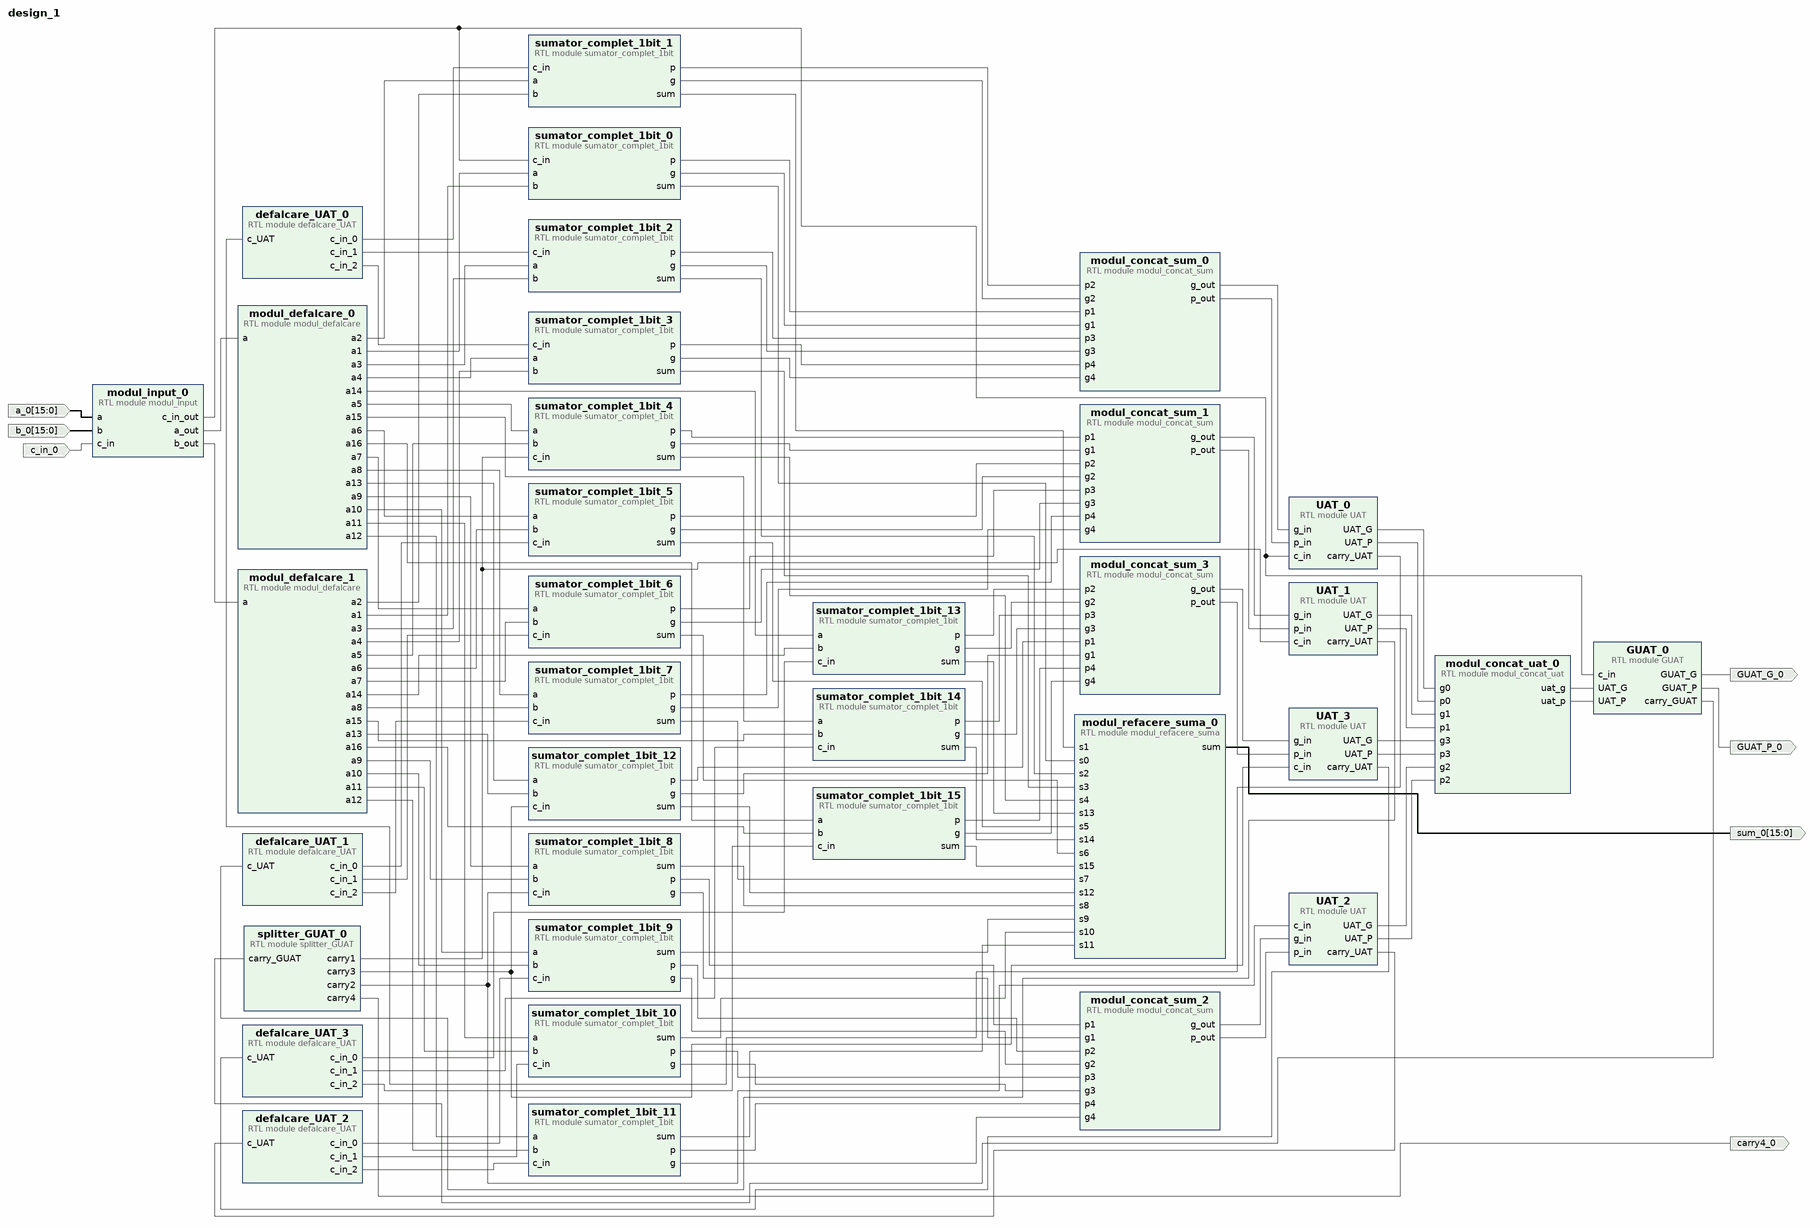
[diagram p0: block diagram of the top level]
# Vivado block design design_1, xc7a100tcsg324-1, Vivado 2020.2
create_bd_design design_1

create_bd_port -dir I -from 15 -to 0 a_0
create_bd_port -dir I -from 15 -to 0 b_0
create_bd_port -dir I c_in_0
create_bd_port -dir O carry4_0
create_bd_port -dir O GUAT_G_0
create_bd_port -dir O GUAT_P_0
create_bd_port -dir O -from 15 -to 0 sum_0

create_bd_cell -type module -reference sumator_complet_1bit sumator_complet_1bit_0
create_bd_cell -type module -reference sumator_complet_1bit sumator_complet_1bit_1
create_bd_cell -type module -reference sumator_complet_1bit sumator_complet_1bit_2
create_bd_cell -type module -reference sumator_complet_1bit sumator_complet_1bit_3
create_bd_cell -type module -reference UAT UAT_0
create_bd_cell -type module -reference modul_concat_sum modul_concat_sum_0
create_bd_cell -type module -reference GUAT GUAT_0
create_bd_cell -type module -reference sumator_complet_1bit sumator_complet_1bit_4
create_bd_cell -type module -reference sumator_complet_1bit sumator_complet_1bit_5
create_bd_cell -type module -reference sumator_complet_1bit sumator_complet_1bit_6
create_bd_cell -type module -reference sumator_complet_1bit sumator_complet_1bit_7
create_bd_cell -type module -reference modul_concat_sum modul_concat_sum_1
create_bd_cell -type module -reference modul_defalcare modul_defalcare_0
create_bd_cell -type module -reference modul_defalcare modul_defalcare_1
create_bd_cell -type module -reference UAT UAT_1
create_bd_cell -type module -reference sumator_complet_1bit sumator_complet_1bit_8
create_bd_cell -type module -reference sumator_complet_1bit sumator_complet_1bit_9
create_bd_cell -type module -reference sumator_complet_1bit sumator_complet_1bit_10
create_bd_cell -type module -reference sumator_complet_1bit sumator_complet_1bit_11
create_bd_cell -type module -reference modul_concat_sum modul_concat_sum_2
create_bd_cell -type module -reference UAT UAT_2
create_bd_cell -type module -reference modul_input modul_input_0
create_bd_cell -type module -reference sumator_complet_1bit sumator_complet_1bit_12
create_bd_cell -type module -reference sumator_complet_1bit sumator_complet_1bit_13
create_bd_cell -type module -reference sumator_complet_1bit sumator_complet_1bit_14
create_bd_cell -type module -reference sumator_complet_1bit sumator_complet_1bit_15
create_bd_cell -type module -reference modul_concat_sum modul_concat_sum_3
create_bd_cell -type module -reference UAT UAT_3
create_bd_cell -type module -reference splitter_GUAT splitter_GUAT_0
create_bd_cell -type module -reference modul_concat_uat modul_concat_uat_0
create_bd_cell -type module -reference defalcare_UAT defalcare_UAT_0
create_bd_cell -type module -reference defalcare_UAT defalcare_UAT_1
create_bd_cell -type module -reference defalcare_UAT defalcare_UAT_2
create_bd_cell -type module -reference defalcare_UAT defalcare_UAT_3
create_bd_cell -type module -reference modul_refacere_suma modul_refacere_suma_0

# ---- connections ----

connect_bd_net [get_bd_pins sumator_complet_1bit_0/p] [get_bd_pins modul_concat_sum_0/p1]
connect_bd_net [get_bd_pins sumator_complet_1bit_1/p] [get_bd_pins modul_concat_sum_0/p2]
connect_bd_net [get_bd_pins sumator_complet_1bit_2/p] [get_bd_pins modul_concat_sum_0/p3]
connect_bd_net [get_bd_pins sumator_complet_1bit_3/p] [get_bd_pins modul_concat_sum_0/p4]
connect_bd_net [get_bd_pins sumator_complet_1bit_0/g] [get_bd_pins modul_concat_sum_0/g1]
connect_bd_net [get_bd_pins sumator_complet_1bit_1/g] [get_bd_pins modul_concat_sum_0/g2]
connect_bd_net [get_bd_pins sumator_complet_1bit_2/g] [get_bd_pins modul_concat_sum_0/g3]
connect_bd_net [get_bd_pins sumator_complet_1bit_3/g] [get_bd_pins modul_concat_sum_0/g4]
connect_bd_net [get_bd_pins sumator_complet_1bit_4/p] [get_bd_pins modul_concat_sum_1/p1]
connect_bd_net [get_bd_pins sumator_complet_1bit_5/p] [get_bd_pins modul_concat_sum_1/p2]
connect_bd_net [get_bd_pins sumator_complet_1bit_6/p] [get_bd_pins modul_concat_sum_1/p3]
connect_bd_net [get_bd_pins sumator_complet_1bit_7/p] [get_bd_pins modul_concat_sum_1/p4]
connect_bd_net [get_bd_pins sumator_complet_1bit_4/g] [get_bd_pins modul_concat_sum_1/g1]
connect_bd_net [get_bd_pins sumator_complet_1bit_5/g] [get_bd_pins modul_concat_sum_1/g2]
connect_bd_net [get_bd_pins sumator_complet_1bit_6/g] [get_bd_pins modul_concat_sum_1/g3]
connect_bd_net [get_bd_pins sumator_complet_1bit_7/g] [get_bd_pins modul_concat_sum_1/g4]
connect_bd_net [get_bd_pins modul_concat_sum_0/g_out] [get_bd_pins UAT_0/g_in]
connect_bd_net [get_bd_pins modul_concat_sum_0/p_out] [get_bd_pins UAT_0/p_in]
connect_bd_net [get_bd_pins modul_concat_sum_1/g_out] [get_bd_pins UAT_1/g_in]
connect_bd_net [get_bd_pins modul_concat_sum_1/p_out] [get_bd_pins UAT_1/p_in]
connect_bd_net [get_bd_pins sumator_complet_1bit_8/p] [get_bd_pins modul_concat_sum_2/p1]
connect_bd_net [get_bd_pins sumator_complet_1bit_9/p] [get_bd_pins modul_concat_sum_2/p2]
connect_bd_net [get_bd_pins sumator_complet_1bit_10/p] [get_bd_pins modul_concat_sum_2/p3]
connect_bd_net [get_bd_pins sumator_complet_1bit_11/p] [get_bd_pins modul_concat_sum_2/p4]
connect_bd_net [get_bd_pins sumator_complet_1bit_8/g] [get_bd_pins modul_concat_sum_2/g1]
connect_bd_net [get_bd_pins sumator_complet_1bit_9/g] [get_bd_pins modul_concat_sum_2/g2]
connect_bd_net [get_bd_pins sumator_complet_1bit_10/g] [get_bd_pins modul_concat_sum_2/g3]
connect_bd_net [get_bd_pins sumator_complet_1bit_11/g] [get_bd_pins modul_concat_sum_2/g4]
connect_bd_net [get_bd_pins modul_concat_sum_2/g_out] [get_bd_pins UAT_2/g_in]
connect_bd_net [get_bd_pins modul_concat_sum_2/p_out] [get_bd_pins UAT_2/p_in]
connect_bd_net [get_bd_pins modul_defalcare_0/a1] [get_bd_pins sumator_complet_1bit_0/a]
connect_bd_net [get_bd_pins modul_defalcare_0/a2] [get_bd_pins sumator_complet_1bit_1/a]
connect_bd_net [get_bd_pins modul_defalcare_0/a3] [get_bd_pins sumator_complet_1bit_2/a]
connect_bd_net [get_bd_pins modul_defalcare_0/a4] [get_bd_pins sumator_complet_1bit_3/a]
connect_bd_net [get_bd_pins modul_defalcare_0/a5] [get_bd_pins sumator_complet_1bit_4/a]
connect_bd_net [get_bd_pins modul_defalcare_0/a6] [get_bd_pins sumator_complet_1bit_5/a]
connect_bd_net [get_bd_pins modul_defalcare_0/a7] [get_bd_pins sumator_complet_1bit_6/a]
connect_bd_net [get_bd_pins modul_defalcare_0/a8] [get_bd_pins sumator_complet_1bit_7/a]
connect_bd_net [get_bd_pins modul_defalcare_0/a9] [get_bd_pins sumator_complet_1bit_8/a]
connect_bd_net [get_bd_pins modul_defalcare_0/a10] [get_bd_pins sumator_complet_1bit_9/a]
connect_bd_net [get_bd_pins modul_defalcare_0/a11] [get_bd_pins sumator_complet_1bit_10/a]
connect_bd_net [get_bd_pins modul_defalcare_0/a12] [get_bd_pins sumator_complet_1bit_11/a]
connect_bd_net [get_bd_pins modul_input_0/a_out] [get_bd_pins modul_defalcare_0/a]
connect_bd_net [get_bd_pins modul_input_0/b_out] [get_bd_pins modul_defalcare_1/a]
connect_bd_net -net a_0_1 [get_bd_ports a_0] [get_bd_pins modul_input_0/a]
connect_bd_net -net b_0_1 [get_bd_ports b_0] [get_bd_pins modul_input_0/b]
connect_bd_net -net c_in_0_1 [get_bd_ports c_in_0] [get_bd_pins modul_input_0/c_in]
connect_bd_net [get_bd_pins modul_defalcare_1/a1] [get_bd_pins sumator_complet_1bit_0/b]
connect_bd_net [get_bd_pins modul_defalcare_1/a2] [get_bd_pins sumator_complet_1bit_1/b]
connect_bd_net [get_bd_pins modul_defalcare_1/a3] [get_bd_pins sumator_complet_1bit_2/b]
connect_bd_net [get_bd_pins modul_defalcare_1/a4] [get_bd_pins sumator_complet_1bit_3/b]
connect_bd_net [get_bd_pins modul_defalcare_1/a5] [get_bd_pins sumator_complet_1bit_4/b]
connect_bd_net [get_bd_pins modul_defalcare_1/a6] [get_bd_pins sumator_complet_1bit_5/b]
connect_bd_net [get_bd_pins modul_defalcare_1/a7] [get_bd_pins sumator_complet_1bit_6/b]
connect_bd_net [get_bd_pins modul_defalcare_1/a8] [get_bd_pins sumator_complet_1bit_7/b]
connect_bd_net [get_bd_pins modul_defalcare_1/a9] [get_bd_pins sumator_complet_1bit_8/b]
connect_bd_net [get_bd_pins modul_defalcare_1/a10] [get_bd_pins sumator_complet_1bit_9/b]
connect_bd_net [get_bd_pins modul_defalcare_1/a11] [get_bd_pins sumator_complet_1bit_10/b]
connect_bd_net [get_bd_pins modul_defalcare_1/a12] [get_bd_pins sumator_complet_1bit_11/b]
connect_bd_net [get_bd_pins modul_input_0/c_in_out] [get_bd_pins sumator_complet_1bit_0/c_in] [get_bd_pins UAT_0/c_in] [get_bd_pins GUAT_0/c_in]
connect_bd_net [get_bd_pins sumator_complet_1bit_12/p] [get_bd_pins modul_concat_sum_3/p1]
connect_bd_net [get_bd_pins sumator_complet_1bit_13/p] [get_bd_pins modul_concat_sum_3/p2]
connect_bd_net [get_bd_pins sumator_complet_1bit_14/p] [get_bd_pins modul_concat_sum_3/p3]
connect_bd_net [get_bd_pins sumator_complet_1bit_15/p] [get_bd_pins modul_concat_sum_3/p4]
connect_bd_net [get_bd_pins sumator_complet_1bit_12/g] [get_bd_pins modul_concat_sum_3/g1]
connect_bd_net [get_bd_pins sumator_complet_1bit_13/g] [get_bd_pins modul_concat_sum_3/g2]
connect_bd_net [get_bd_pins sumator_complet_1bit_14/g] [get_bd_pins modul_concat_sum_3/g3]
connect_bd_net [get_bd_pins sumator_complet_1bit_15/g] [get_bd_pins modul_concat_sum_3/g4]
connect_bd_net [get_bd_pins modul_concat_sum_3/g_out] [get_bd_pins UAT_3/g_in]
connect_bd_net [get_bd_pins modul_concat_sum_3/p_out] [get_bd_pins UAT_3/p_in]
connect_bd_net [get_bd_pins modul_defalcare_0/a13] [get_bd_pins sumator_complet_1bit_12/a]
connect_bd_net [get_bd_pins modul_defalcare_0/a14] [get_bd_pins sumator_complet_1bit_13/a]
connect_bd_net [get_bd_pins modul_defalcare_0/a15] [get_bd_pins sumator_complet_1bit_14/a]
connect_bd_net [get_bd_pins modul_defalcare_0/a16] [get_bd_pins sumator_complet_1bit_15/a]
connect_bd_net [get_bd_pins modul_defalcare_1/a13] [get_bd_pins sumator_complet_1bit_12/b]
connect_bd_net [get_bd_pins modul_defalcare_1/a14] [get_bd_pins sumator_complet_1bit_13/b]
connect_bd_net [get_bd_pins modul_defalcare_1/a15] [get_bd_pins sumator_complet_1bit_14/b]
connect_bd_net [get_bd_pins modul_defalcare_1/a16] [get_bd_pins sumator_complet_1bit_15/b]
connect_bd_net [get_bd_pins GUAT_0/carry_GUAT] [get_bd_pins splitter_GUAT_0/carry_GUAT]
connect_bd_net [get_bd_pins splitter_GUAT_0/carry4] [get_bd_ports carry4_0]
connect_bd_net [get_bd_pins GUAT_0/GUAT_G] [get_bd_ports GUAT_G_0]
connect_bd_net [get_bd_pins GUAT_0/GUAT_P] [get_bd_ports GUAT_P_0]
connect_bd_net [get_bd_pins splitter_GUAT_0/carry1] [get_bd_pins UAT_1/c_in] [get_bd_pins sumator_complet_1bit_4/c_in]
connect_bd_net [get_bd_pins splitter_GUAT_0/carry2] [get_bd_pins UAT_2/c_in] [get_bd_pins sumator_complet_1bit_8/c_in]
connect_bd_net [get_bd_pins splitter_GUAT_0/carry3] [get_bd_pins UAT_3/c_in] [get_bd_pins sumator_complet_1bit_12/c_in]
connect_bd_net [get_bd_pins UAT_0/UAT_G] [get_bd_pins modul_concat_uat_0/g0]
connect_bd_net [get_bd_pins UAT_0/UAT_P] [get_bd_pins modul_concat_uat_0/p0]
connect_bd_net [get_bd_pins UAT_1/UAT_G] [get_bd_pins modul_concat_uat_0/g1]
connect_bd_net [get_bd_pins UAT_1/UAT_P] [get_bd_pins modul_concat_uat_0/p1]
connect_bd_net [get_bd_pins UAT_2/UAT_G] [get_bd_pins modul_concat_uat_0/g2]
connect_bd_net [get_bd_pins UAT_2/UAT_P] [get_bd_pins modul_concat_uat_0/p2]
connect_bd_net [get_bd_pins UAT_3/UAT_G] [get_bd_pins modul_concat_uat_0/g3]
connect_bd_net [get_bd_pins UAT_3/UAT_P] [get_bd_pins modul_concat_uat_0/p3]
connect_bd_net [get_bd_pins modul_concat_uat_0/uat_g] [get_bd_pins GUAT_0/UAT_G]
connect_bd_net [get_bd_pins modul_concat_uat_0/uat_p] [get_bd_pins GUAT_0/UAT_P]
connect_bd_net [get_bd_pins sumator_complet_1bit_0/sum] [get_bd_pins modul_refacere_suma_0/s0]
connect_bd_net [get_bd_pins sumator_complet_1bit_1/sum] [get_bd_pins modul_refacere_suma_0/s1]
connect_bd_net [get_bd_pins sumator_complet_1bit_2/sum] [get_bd_pins modul_refacere_suma_0/s2]
connect_bd_net [get_bd_pins sumator_complet_1bit_3/sum] [get_bd_pins modul_refacere_suma_0/s3]
connect_bd_net [get_bd_pins sumator_complet_1bit_4/sum] [get_bd_pins modul_refacere_suma_0/s4]
connect_bd_net [get_bd_pins sumator_complet_1bit_5/sum] [get_bd_pins modul_refacere_suma_0/s5]
connect_bd_net [get_bd_pins sumator_complet_1bit_6/sum] [get_bd_pins modul_refacere_suma_0/s6]
connect_bd_net [get_bd_pins sumator_complet_1bit_7/sum] [get_bd_pins modul_refacere_suma_0/s7]
connect_bd_net [get_bd_pins sumator_complet_1bit_8/sum] [get_bd_pins modul_refacere_suma_0/s8]
connect_bd_net [get_bd_pins sumator_complet_1bit_9/sum] [get_bd_pins modul_refacere_suma_0/s9]
connect_bd_net [get_bd_pins sumator_complet_1bit_10/sum] [get_bd_pins modul_refacere_suma_0/s10]
connect_bd_net [get_bd_pins sumator_complet_1bit_11/sum] [get_bd_pins modul_refacere_suma_0/s11]
connect_bd_net [get_bd_pins sumator_complet_1bit_12/sum] [get_bd_pins modul_refacere_suma_0/s12]
connect_bd_net [get_bd_pins sumator_complet_1bit_13/sum] [get_bd_pins modul_refacere_suma_0/s13]
connect_bd_net [get_bd_pins sumator_complet_1bit_14/sum] [get_bd_pins modul_refacere_suma_0/s14]
connect_bd_net [get_bd_pins sumator_complet_1bit_15/sum] [get_bd_pins modul_refacere_suma_0/s15]
connect_bd_net [get_bd_pins modul_refacere_suma_0/sum] [get_bd_ports sum_0]
connect_bd_net [get_bd_pins UAT_0/carry_UAT] [get_bd_pins defalcare_UAT_0/c_UAT]
connect_bd_net [get_bd_pins defalcare_UAT_0/c_in_0] [get_bd_pins sumator_complet_1bit_1/c_in]
connect_bd_net [get_bd_pins defalcare_UAT_0/c_in_1] [get_bd_pins sumator_complet_1bit_2/c_in]
connect_bd_net [get_bd_pins defalcare_UAT_0/c_in_2] [get_bd_pins sumator_complet_1bit_3/c_in]
connect_bd_net [get_bd_pins UAT_1/carry_UAT] [get_bd_pins defalcare_UAT_1/c_UAT]
connect_bd_net [get_bd_pins defalcare_UAT_1/c_in_0] [get_bd_pins sumator_complet_1bit_5/c_in]
connect_bd_net [get_bd_pins defalcare_UAT_1/c_in_1] [get_bd_pins sumator_complet_1bit_6/c_in]
connect_bd_net [get_bd_pins defalcare_UAT_1/c_in_2] [get_bd_pins sumator_complet_1bit_7/c_in]
connect_bd_net [get_bd_pins UAT_2/carry_UAT] [get_bd_pins defalcare_UAT_2/c_UAT]
connect_bd_net [get_bd_pins defalcare_UAT_2/c_in_0] [get_bd_pins sumator_complet_1bit_9/c_in]
connect_bd_net [get_bd_pins defalcare_UAT_2/c_in_1] [get_bd_pins sumator_complet_1bit_10/c_in]
connect_bd_net [get_bd_pins defalcare_UAT_2/c_in_2] [get_bd_pins sumator_complet_1bit_11/c_in]
connect_bd_net [get_bd_pins UAT_3/carry_UAT] [get_bd_pins defalcare_UAT_3/c_UAT]
connect_bd_net [get_bd_pins defalcare_UAT_3/c_in_0] [get_bd_pins sumator_complet_1bit_13/c_in]
connect_bd_net [get_bd_pins defalcare_UAT_3/c_in_1] [get_bd_pins sumator_complet_1bit_14/c_in]
connect_bd_net [get_bd_pins defalcare_UAT_3/c_in_2] [get_bd_pins sumator_complet_1bit_15/c_in]

validate_bd_design
save_bd_design
